# EAGLE design amplifier (EAGLE 9.6.1)
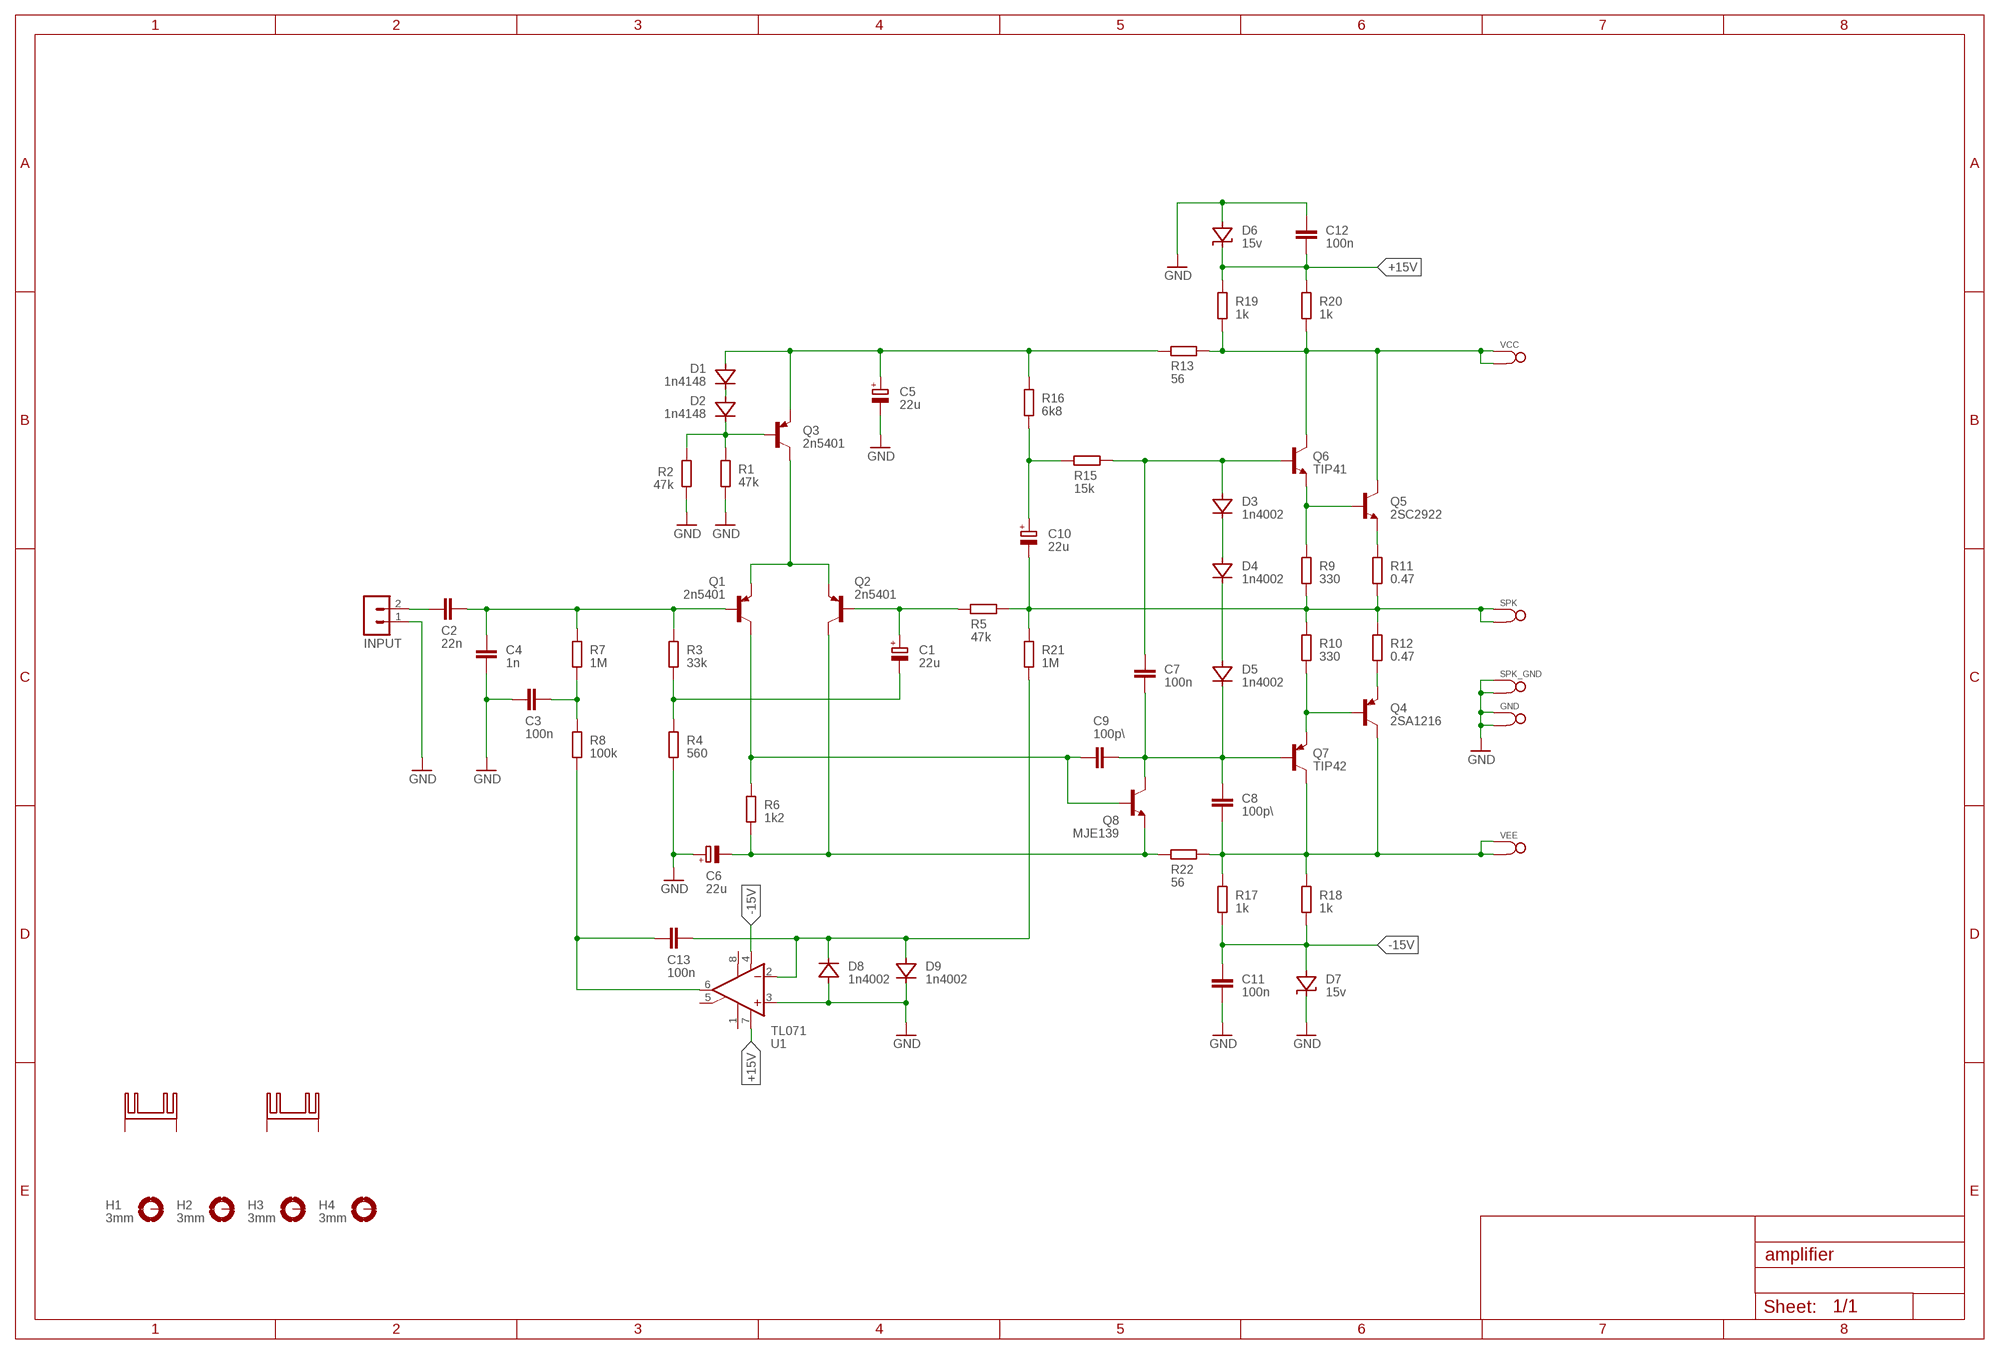
[diagram p0: schematic, sheet 1]

## Parts
C1  22u  C6  [E2,5-6]
C2  22n  C  [C050-024X044]
C3  100n  C  [C050-024X044]
C4  1n  C  [C050-024X044]
C5  22u  C8  [E3,5-8]
C6  22u  C8  [E3,5-8]
C7  100n  C  [C050-024X044]
C8  100p\  C  [C050-024X044]
C9  100p\  C  [C050-024X044]
C10  22u  C8  [E3,5-8]
C11  100n  C  [C050-024X044]
C12  100n  C  [C050-024X044]
C13  100n  C  [C050-024X044]
CON1  INPUT  JST-2P  [2P]
D1  1n4148  D  [DO35Z7]
D2  1n4148  D  [DO35Z7]
D3  1n4002  D  [DO35Z7]
D4  1n4002  D  [DO35Z7]
D5  1n4002  D  [DO35Z7]
D6  15v  DZ  [DO35Z7]
D7  15v  DZ  [DO35Z7]
D8  1n4002  D  [DO35Z7]
D9  1n4002  D  [DO35Z7]
GND  SPADE  [SPADE-POWER]
H1  3mm  MOUNT-PAD-ROUND3.0  [3,0-PAD]
H2  3mm  MOUNT-PAD-ROUND3.0  [3,0-PAD]
H3  3mm  MOUNT-PAD-ROUND3.0  [3,0-PAD]
H4  3mm  MOUNT-PAD-ROUND3.0  [3,0-PAD]
KK1  SK104-PAD  [SK104-PAD]
KK2  SK104-PAD  [SK104-PAD]
Q1  2n5401  PNP-TO92  [TO92-BCE]
Q2  2n5401  PNP-TO92  [TO92-BCE]
Q3  2n5401  PNP-TO92  [TO92-BCE]
Q4  2SA1216  PNP-MT200  [MT200L]
Q5  2SC2922  NPN-MT200  [MT200L]
Q6  TIP41  NPN-TO220  [TO220V]
Q7  TIP42  PNP-TO220  [TO220V]
Q8  MJE139  NPN-TO126  [TO126V]
R1  47k  R0.5  [0309/12]
R2  47k  R0.5  [0309/12]
R3  33k  R0.5  [0309/12]
R4  560  R0.5  [0309/12]
R5  47k  R0.5  [0309/12]
R6  1k2  R0.5  [0309/12]
R7  1M  R0.5  [0309/12]
R8  100k  R0.5  [0309/12]
R9  330  R2  [0617/17]
R10  330  R2  [0617/17]
R11  0.47  R5  [0922/22]
R12  0.47  R5  [0922/22]
R13  56  R0.5  [0309/12]
R15  15k  R0.5  [0309/12]
R16  6k8  R0.5  [0309/12]
R17  1k  R0.5  [0309/12]
R18  1k  R0.5  [0309/12]
R19  1k  R0.5  [0309/12]
R20  1k  R0.5  [0309/12]
R21  1M  R0.5  [0309/12]
R22  56  R0.5  [0309/12]
SPK  SPADE  [SPADE-POWER]
SPK_GND  SPADE  [SPADE-POWER]
U1  TL071  [DIL08]
VCC  SPADE  [SPADE-POWER]
VEE  SPADE  [SPADE-POWER]

## Nets
+15V: C12.1 D6.C R19.2 R20.2 U1.7(V+)
-15V: C11.2 D7.A R17.1 R18.1 U1.4(V-)
GND: C3.1 C4.1 C5.- C6.+ C11.1 C12.2 CON1.1 D6.A D7.C D8.A D9.C GND.P$1 GND.P$2 R1.1 R2.1 R4.1 SPK_GND.P$1 SPK_GND.P$2 U1.3(+IN)
N$1: D2.C Q3.B R1.2 R2.2
N$2: D1.C D2.A
N$3: Q5.C Q6.C R13.1 R19.1 R20.1 VCC.P$1 VCC.P$2
N$4: C2.2 C4.2 Q1.B R3.2 R7.2
N$5: C1.- R3.1 R4.2
N$6: C1.+ Q2.B R5.2
N$7: C13.2 D8.C D9.A R21.1 U1.2(-IN)
N$8: Q1.E Q2.E Q3.C
N$9: C3.2 R7.1 R8.2
N$10: Q4.E R12.1
N$11: C2.1 CON1.2
N$12: C10.- R5.1 R9.1 R10.2 R11.1 R12.2 R21.2 SPK.P$1 SPK.P$2
N$13: Q5.E R11.2
N$14: C7.2 D3.A Q6.B R15.1
N$15: Q4.B Q7.E R10.1
N$16: Q5.B Q6.E R9.2
N$17: D3.C D4.A
N$18: D4.C D5.A
N$19: C7.1 C8.1 C9.2 D5.C Q7.B Q8.C
N$20: C9.1 Q1.C Q8.B R6.2
N$21: C8.2 Q4.C Q7.C R17.2 R18.2 R22.1 VEE.P$1 VEE.P$2
N$22: C6.- Q2.C Q8.E R6.1 R22.2
N$23: C5.+ D1.A Q3.E R13.2 R16.2
N$24: C10.+ R15.2 R16.1
N$25: C13.1 R8.1 U1.6(OUT)
Unconnected: H1.B3,0(MOUNT) H2.B3,0(MOUNT) H3.B3,0(MOUNT) H4.B3,0(MOUNT) KK1.K1(K) KK1.K2(K) KK2.K1(K) KK2.K2(K) U1.1(ON1) U1.5(ON2) U1.8(OPT)

## Library data of the parts
C1 = amplifier:C6
C2-C4 C7-C9 C11-C13 = amplifier:C
C5 C6 C10 = amplifier:C8
CON1 = amplifier:JST-2P
D1-D5 D8 D9 = amplifier:D
D6 D7 = amplifier:DZ
GND SPK SPK_GND VCC VEE = amplifier:SPADE
H1-H4 = holes:MOUNT-PAD-ROUND: MOUNTING PAD, round
KK1 KK2 = heatsink:SK104-PAD: HEATSINK manufacturer Fischer/distributor Buerklin
Q1-Q3 = amplifier:PNP-TO92
Q4 = amplifier:PNP-MT200
Q5 = amplifier:NPN-MT200
Q6 = amplifier:NPN-TO220
Q7 = amplifier:PNP-TO220
Q8 = amplifier:NPN-TO126
R1-R8 R13 R15-R22 = amplifier:R0.5
R9 R10 = amplifier:R2
R11 R12 = amplifier:R5
U1 = amplifier:TL071

## Board
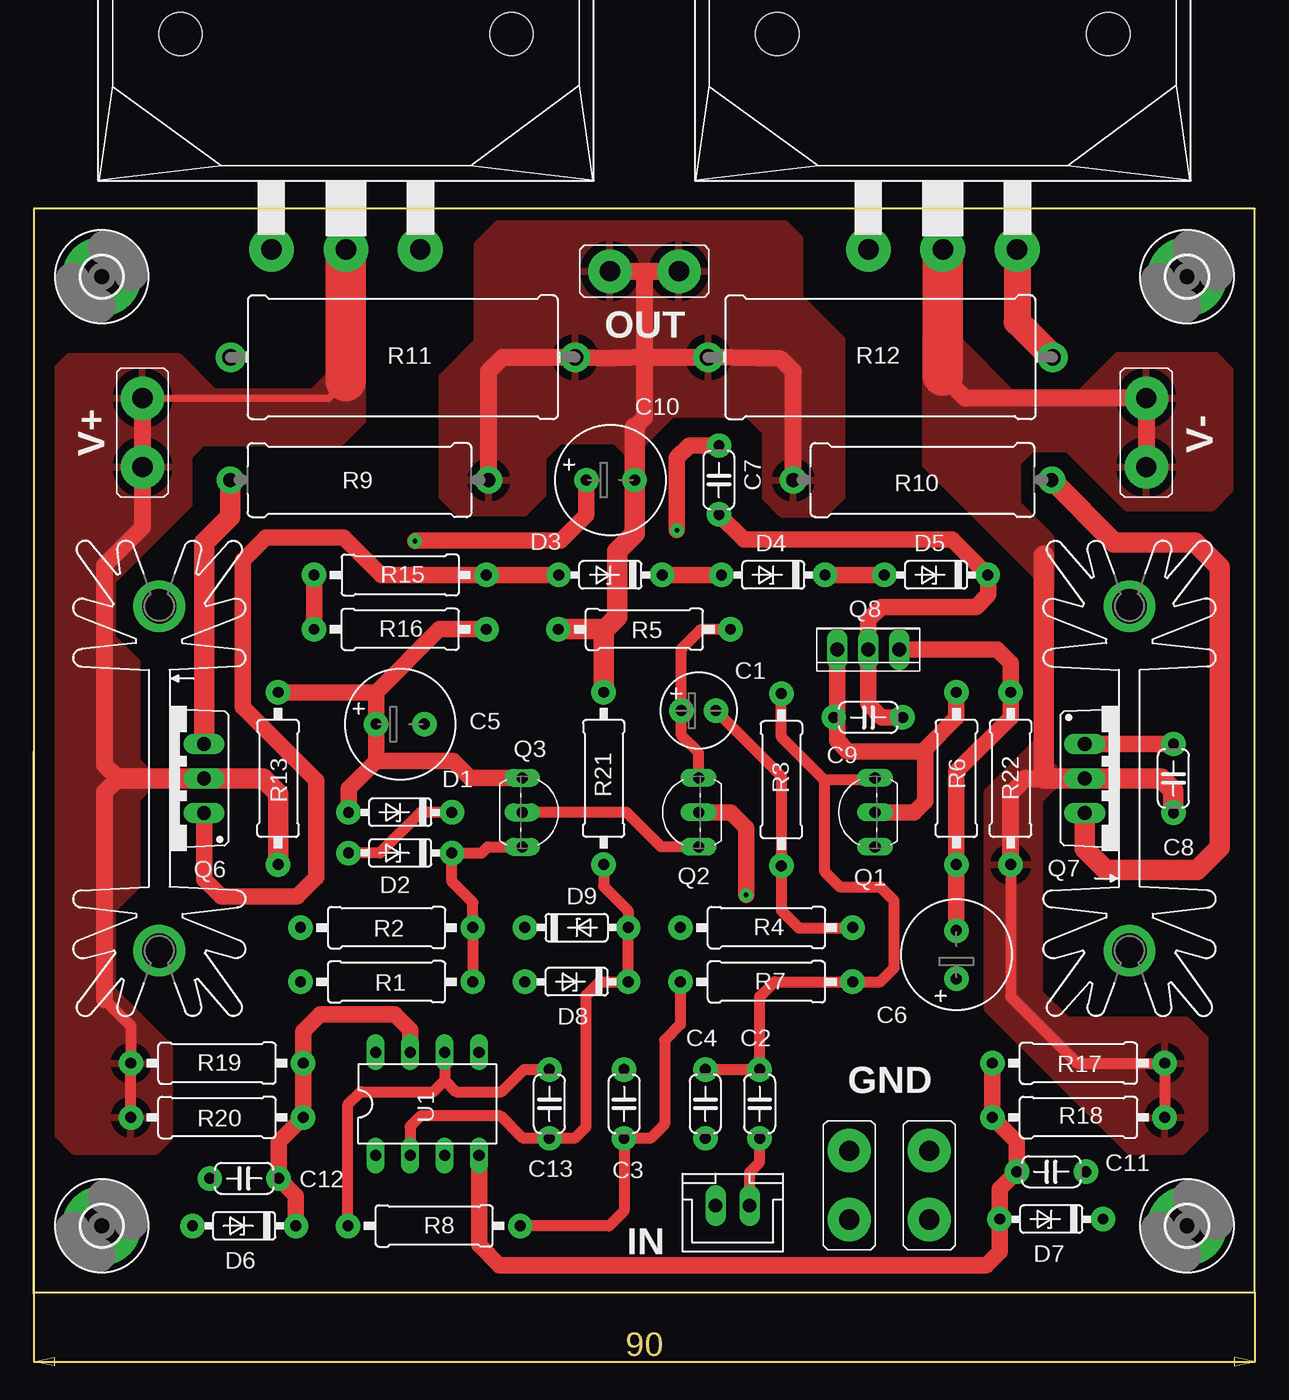
[diagram p1: board, top side]
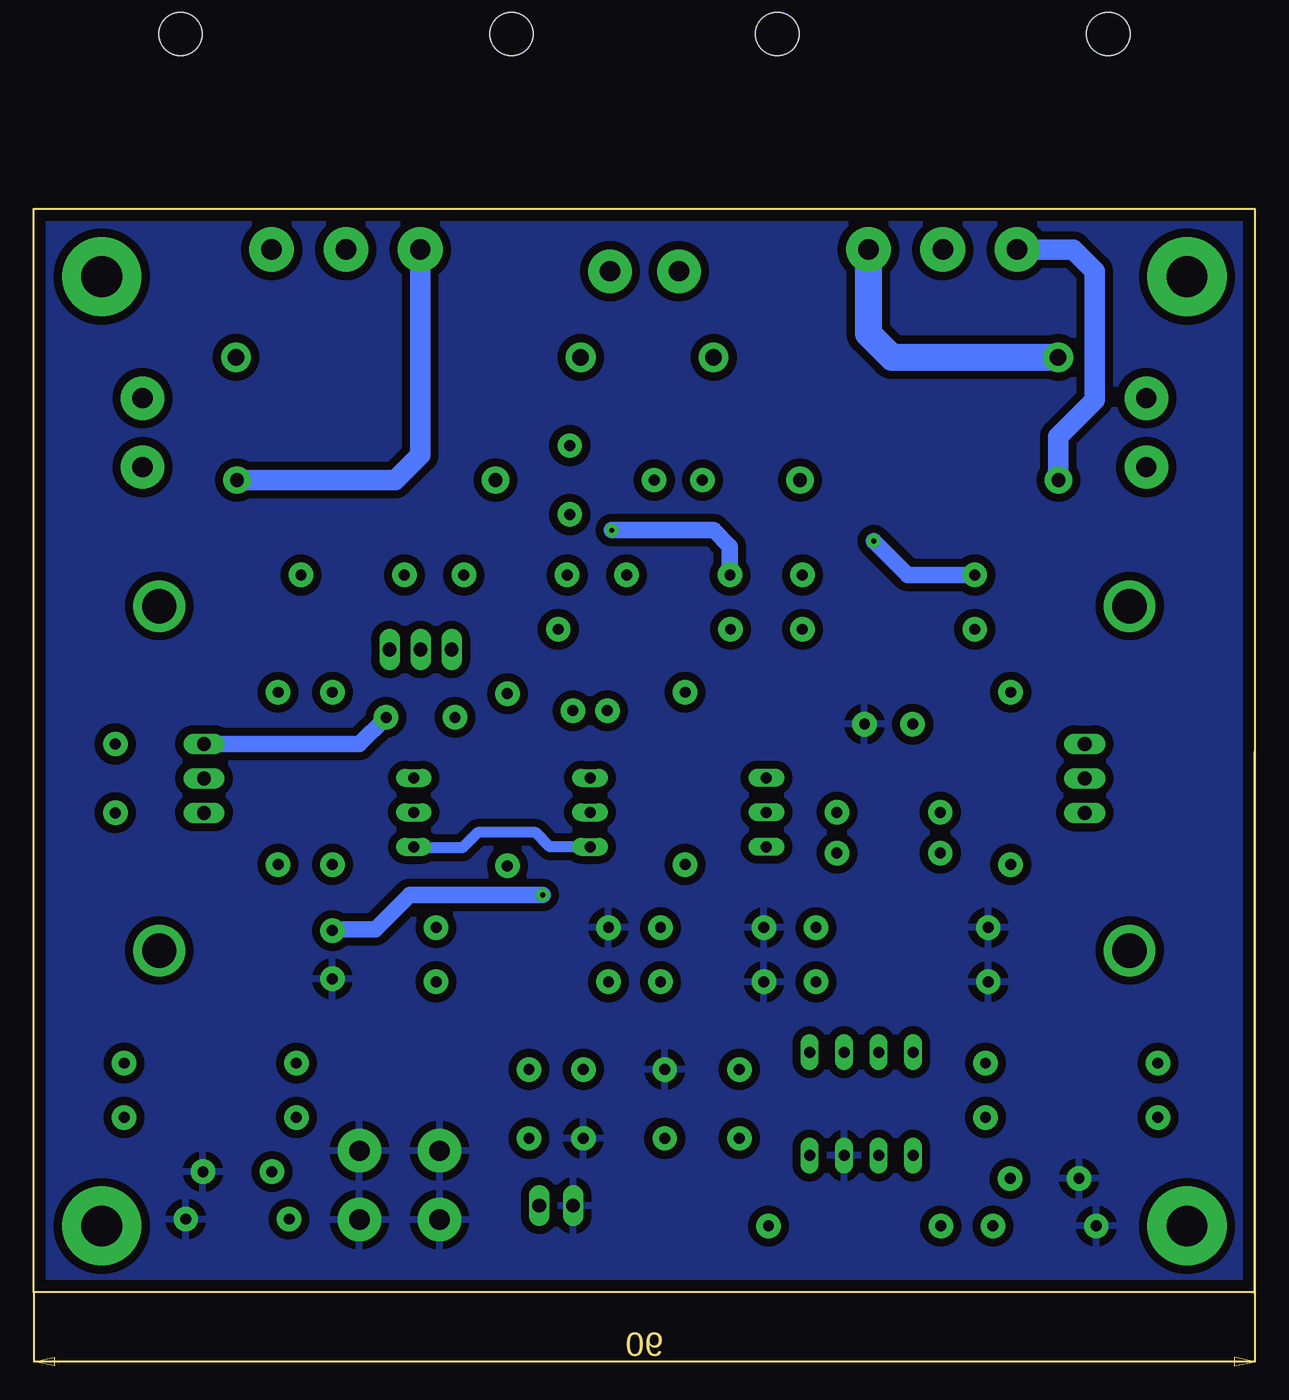
[diagram p2: board, bottom side, seen from below]

Size 90 x 79.9 mm. Coordinates in mm from the lower left corner, seen from the top.
Outline: 0,0 90,0 90,79.9 0,79.9 0,0
Copper layers (1*16): Top 0.035mm / dielectric 1.5mm / Bottom 0.035mm
Design rules "default *": minimum track width 0.5mm, minimum drill 0.3mm, track to track 0.3mm, track to pad 0.3mm, pad to pad 0.3mm, via to via 0.3mm, smd to smd 0.3mm, copper to edge 0.8mm, drill to drill 0.5mm, minimum pad ring 10mil, minimum via ring 8mil, stop-mask expansion 4mil, vias tented up to drill 3mm, thermal gap 0.6mm

### Footprints (pad centres in the part's own frame; a part is rotated, then mirrored left to right if it is on the bottom)
E2,5-6 = drill 0.8 pad 1.8: + -1.27,0; - 1.27,0
C050-024X044 = drill 0.8 pad 1.8: 1 -2.54,0; 2 2.54,0
E3,5-8 = drill 0.8 pad 1.8: + -1.778,0; - 1.778,0
2P = drill 1 long: 1 -1.25,0; 2 1.25,0
DO35Z7 = drill 0.8 pad 1.8: A 3.81,0; C -3.81,0
SPADE-POWER = drill 1.5 pad 3.2: P$1 2.54,0; P$2 -2.54,0
3,0-PAD = drill 3 pad 5.842: B3,0 0,0
SK104-PAD = drill 2.54 pad 3.81: K1 -12.7,-0.762; K2 12.7,-0.762
TO92-BCE = drill 0.813 long: B 2.54,0; C 0,0; E -2.54,0
MT200L = drill 1.5 pad 3.3: B -5.48,0; C 0,0; E 5.48,0 | hole 3.2: -12.2,15.9; 12.2,15.9
TO220V = drill 1.016 long: B -2.54,-2.54; C 0,-2.54; E 2.54,-2.54
TO126V = drill 1.016 long: B 2.286,0; C 0,0; E -2.286,0
0309/12 = drill 0.8 pad 1.8: 1 -6.35,0; 2 6.35,0
0617/17 = drill 1 pad 2: 1 -9.525,0; 2 9.525,0
0922/22 = drill 1.2 pad 2.2: 1 -12.7,0; 2 12.7,0
DIL08 = drill 0.813 long: 1 -3.81,-3.81; 2 -1.27,-3.81; 3 1.27,-3.81; 4 3.81,-3.81; 5 3.81,3.81; 6 1.27,3.81; 7 -1.27,3.81; 8 -3.81,3.81

### Placement (x,y rotation side)
C1  49,42.9 0 top
C2  53.5,13.9 90 top
C3  43.5,13.9 270 top
C4  49.5,13.9 90 top
C5  27,41.9 0 top
C6  68,24.9 90 top
C7  50.5,59.9 90 top
C8  84,37.9 270 top
C9  61.5,42.4 0 top
C10  42.5,59.9 0 top
C11  75,8.9 180 top
C12  15.5,8.4 180 top
C13  38,13.9 270 top
CON1  51.5,6.4 0 top
D1  27,35.4 180 top
D2  27,32.4 180 top
D3  42.5,52.9 180 top
D4  54.5,52.9 180 top
D5  66.5,52.9 180 top
D6  15.5,4.9 180 top
D7  75,5.4 180 top
D8  40,22.9 180 top
D9  40,26.9 0 top
GND  60.1,7.9 90 top
H1  5,4.9 0 top
H2  85,74.9 0 top
H3  5,74.9 0 top
H4  85,4.9 0 top
KK1  10,37.9 270 top
KK2  80,37.9 90 top
Q1  62,35.4 90 top
Q2  49,35.4 90 top
Q3  36,35.4 270 top
Q4  67,76.9 0 top
Q5  23,76.9 0 top
Q6  10,37.9 90 top
Q7  80,37.9 270 top
Q8  61.5,47.4 180 top
R1  26,22.9 0 top
R2  26,26.9 0 top
R3  55.1,37.8 90 top
R4  54,26.9 0 top
R5  45,48.9 0 top
R6  68,37.9 90 top
R7  54,22.9 0 top
R8  29.5,4.9 0 top
R9  24,59.9 180 top
R10  65.5,59.9 180 top
R11  27.2,68.95 180 top
R12  62.4,68.95 180 top
R13  18,37.9 90 top
R15  27,52.9 180 top
R16  27,48.9 0 top
R17  77,16.9 0 top
R18  77,12.9 0 top
R19  13.5,16.9 0 top
R20  13.5,12.9 0 top
R21  42,37.9 90 top
R22  72,37.9 90 top
SPK  45,75.3 0 top
SPK_GND  66,7.9 270 top
U1  29,13.9 0 top
VCC  8,63.4 90 top
VEE  82,63.4 90 top

### Tracks (layer width: path | path; a pad name or v marks a point on that pad's centre or on a via)
+15V
  Top 1.2: D6.C 19.31,7.13 C12.1 18.04,11.09 R20.2 R19.2 19.85,19.25 21.1,20.5 26.6,20.5 27.73,19.37 U1.7
-15V
  Top 1.2: R17.1 R18.1 72.46,11.09 C11.2 71.19,7.63 D7.A 71.19,2.99 70.2,2 34.3,2 32.81,3.49 U1.4
GND
  pour Bottom (isolate 0.6): 0,79.9 90,79.9 90,0 0,0
N$1
  Top 0.8: Q3.B 33.46,32.86 33,32.4 D2.C 30.81,30.29 32.35,28.75 R2.2 R1.2
N$2
  Top 0.8: D1.C 28.5,35.4 25.5,32.4 D2.A
N$3
  Top 0.5: 23,67.2 21.7,65.9 8.04,65.9 VCC.P$1
  Top 0.8: R20.1 R19.1 7.15,19.65 5.2,21.6
  Top 1.27: VCC.P$1 VCC.P$2 8,56.4 5.2,53.6 5.2,38.9 6.2,37.9 5.2,36.9 5.2,21.6
  Top 1.5: R13.1 18,36.8 16.9,37.9 Q6.C 6.2,37.9
  Top 3: Q5.C 23,67.2
  pour Top (isolate 0.6): 21.9,75.1 21.9,67.8 20.5,66.4 13.3,66.4 10.7,69 2.55,69 1.75,68.2 1.75,11.6 2.95,10.4 9,10.4 10,11.4 10,18.1 5.8,22.3 5.8,28.2 7.6,30 7.6,36.4 8.5,37.3 8.5,38.3 7.6,39.2 7.6,46.5 5.8,48.3 5.8,52.45 11.45,58.1 11.45,61.65 12.45,62.65 22.6,62.65 24.25,64.3 24.25,75.1
N$4
  Top 0.8: Q1.B 61.85,37.79 58.26,37.79 | 58.26,37.79 55.1,40.95 R3.2 | 58.26,37.79 58.26,31.04 59.4,29.9 62.4,29.9 63.4,28.9 63.4,23.9 62.4,22.9 R7.2 54.6,22.9 53.5,21.8 C2.2 C4.2
N$5
  Top 0.8: C1.- 55.1,38.07 R3.1 55.1,28.15 56.4,26.85 60.3,26.85 R4.2
N$6
  Top 0.8: Q2.B 49,39.8 47.73,41.07 C1.+ 47.73,47.43 49.2,48.9 R5.2
N$7
  Top 0.8: R21.1 42,29.95 43.81,28.14 D9.A D8.C 41.7,22.9 40.7,21.9 40.7,12.2 39.86,11.36 C13.2 36.04,11.36 34.4,13 28.5,13 27.73,12.23 U1.2
N$8
  Top 0.8: Q2.E 46.24,32.86 43.7,35.4 Q3.C
  Bottom 0.8: Q2.E 51.96,32.86 53,33.9 57.3,33.9 58.4,32.8 61.94,32.8 Q1.E
N$9
  Top 0.8: R8.2 42.4,4.9 43.5,6 C3.2 45.46,11.36 46.5,12.4 46.5,18.6 47.65,19.75 R7.1
N$10
  Top 2: Q4.E 72.48,71.57 R12.1
N$11
  Top 0.8: CON1.2 52.75,8.85 53.5,9.6 C2.1
N$12
  Top 0.8: 44.3,59.88 C10.-
  Top 1.27: R5.1 42,48.9 | SPK.P$2 45,75.3 | 45,75.3 SPK.P$1 | 45,75.3 45,64.5 44.28,63.78 | R9.1 33.52,67.92 34.55,68.95 34.7,68.95 R11.1 42.85,68.89 45.35,68.95 R12.2 55.05,68.86 55.98,67.92 R10.2
  Top 1.5: 42,48.9 R21.2 | 44.3,59.88 44.3,55.95 43,54.65 43,49.8 42.1,48.9 R5.1 | C10.- 44.28,63.78
  pour Top (isolate 0.6): 31.25,57.5 36.2,57.5 37.55,58.85 37.55,61.55 38.8,62.8 42.8,62.8 43.95,61.65 47.05,64.75 52.6,64.75 53.9,63.45 53.9,58.6 55.1,57.4 58.3,57.4 59.6,58.7 59.6,70.25 56.5,73.35 56.5,77.7 55.1,79.1 34.5,79.1 32.65,77.25 32.65,70.1 30.05,67.5 30.05,58.7
N$13
  Bottom 2: Q5.E 28.48,70.68 26.75,68.95 R11.2
N$14  (via drill 0.35 pad 1)
  Top 1.2: D3.A R15.1 25.6,52.9 22.85,55.65 17.1,55.65 15.4,53.95 15.4,43.15 20.8,37.75 20.8,30.6 19.4,29.2 13.8,29.2 12.54,30.46 Q6.B | C7.2 48.29,62.44 47.4,61.55 v47.4,56.2
  Bottom 1.2: v47.4,56.2 39.9,56.2 38.69,54.99 D3.A
N$15
  Top 1.5: Q7.E 77.46,32.69 79,31.15 85.75,31.15 87.4,32.8 87.4,53.5 85.6,55.3 79.65,55.3 75.05,59.9 R10.1
  Bottom 1.5: Q4.B 61.52,61.73 63.35,59.9 R10.1
N$16
  Top 1.5: Q6.E 12.54,55.29 14.47,57.23 R9.2
  Bottom 0.5: 14.5,59.92 R9.2
  Bottom 1.5: Q5.B 13.4,76.9 11.8,75.3 11.8,65.8 14.5,63.1 14.5,59.92
N$17
  Top 1.2: D3.C D4.A
N$18
  Top 1.2: D4.C D5.A
N$19
  Top 0.5: 70.35,52.86 D5.C
  Top 0.8: C7.1
  Top 1.2: Q7.B C8.1 | C9.2 62.5,42.4 61.5,43.4 Q8.C 61.5,49.6 62.45,50.55 69.45,50.55 70.35,51.45 70.35,52.86 | C7.1 52.35,55.5 67.71,55.5 D5.C
  Bottom 1.2: Q7.B 66,40.44 C9.2
N$20
  Top 0.8: 59.21,42.65 C9.1
  Top 1.2: Q8.B 59.21,42.65 | C9.1 59.2,42.16 59.2,40.7 60,39.9 65.65,39.9 | 65.65,39.9 65.7,39.9 65.7,36.2 64.9,35.4 Q1.C | 65.65,39.9 65.65,40.05 68,42.4 R6.2
N$21
  Top 0.8: R18.2 R17.2 76.9,16.9 72,21.8 R22.1
  Top 1.27: R22.1 72,36.8 73.1,37.9 74.45,37.9 | VEE.P$2 VEE.P$1 68.66,65.94 67,67.6
  Top 1.5: C8.2 84,37 83.1,37.9 Q7.C 74.45,37.9 74.45,54.35
  Top 3: 67,67.6 Q4.C
  pour Top (isolate 0.6): 67.75,70.65 72.35,66.05 76.85,66.05 79.9,69.1 87.1,69.1 88.15,68.05 88.15,59.15 86.85,57.85 80.55,57.85 76.2,62.2 73.55,62.2 72.5,61.15 72.5,58.15 74.95,55.7 74.95,51.75 65.75,60.95 65.75,70.65
  pour Top (isolate 0.6): 74.6,41.25 70.25,36.9 70.25,20.9 80.75,10.4 84.7,10.4 86.35,12.05 86.35,18.7 85,20.05 76.2,20.05 74.15,22.1 74.15,36.3 75.75,37.9 75.75,38.15 74.6,39.3
N$22  (via drill 0.35 pad 1)
  Top 1.2: Q8.E 71,47.4 72,46.4 R22.2 72,42.4 68,38.4 R6.1 C6.- | Q2.C 51.35,35.4 52.5,34.25 v52.5,29.3
  Bottom 0.8: C6.- 67.9,26.78
  Bottom 1.2: v52.5,29.3 62.3,29.3 64.82,26.78 67.9,26.78
N$23
  Top 1.2: R13.2 25.22,44.25 | 25.22,44.25 C5.+ 25.22,39.17 | 25.22,44.25 29.87,48.9 R16.2 | D1.A 23.19,37.14 25.22,39.17 | 25.22,39.17 30.93,39.17 32.16,37.94 Q3.E
N$24  (via drill 0.35 pad 1)
  Top 1.2: R16.1 R15.2 | C10.+ 40.72,57.32 38.85,55.45 28.15,55.45 v28.1,55.4
  Bottom 1.2: v28.1,55.4 25.6,52.9 R15.2
N$25
  Top 0.8: U1.6 30.27,15.63 | 30.27,15.63 31.1,14.8 34.5,14.8 36.14,16.44 C13.1 | R8.1 23.15,13.85 24.1,14.8 29.44,14.8 30.27,15.63

### Text on the board
tPlace: OUT | V+ | V- | GND | IN